# Altium schematic sheet GSB-S05-V00-PSU5V.SchDoc
size A4
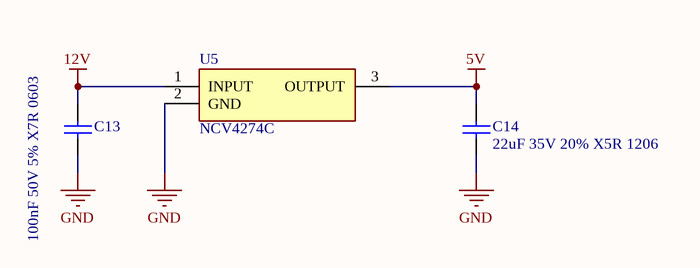
[diagram p0: GSB-S05-V00-PSU5V.SchDoc]

## Parts
C13  100nF 50V 5% X7R 0603  [Cap_Ceramic_0603]
C14  22uF 35V 20% X5R 1206  [Cap_Ceramic_1206]
U5  NCV4274C  [NCV4274CDT50RKG]

## Nets
5V: C14.2 U5.3(OUTPUT)
12V: C13.2 U5.1(INPUT)
GND: C13.1 C14.1 U5.2(GND)

## Library data of the parts
C13 = 100nF 50V 5% X7R 0603: Capacitor, Ceramic, SMD, 100nF, 50V, 5%, X7R, 0603
C14 = 22uF 35V 20% X5R 1206: 22µF ±20% 35V Ceramic Capacitor X5R 1206 (3216 Metric); ComponentLink1Description: Digikey; ComponentLink1URL: https://www.digikey.com.au/product-detail/en/tdk-corporation/C3216X5R1V226M160AC/445-8045-1-ND/2792165; ComponentLink2Description: Datasheet; ComponentLink2URL: https://product.tdk.com/info/en/catalog/datasheets/mlcc_commercial_general_en.pdf
U5 = NCV4274C: Integrated Circuit; Manufacturer_Name: ON Semiconductor; Datasheet Link: https://www.onsemi.com/pub/Collateral/NCV4274C-D.PDF; Height: 2.38mm; Manufacturer_Part_Number: NCV4274CDT50RKG; Arrow Part Number: NCV4274CDT50RKG; Arrow Price/Stock: https://www.arrow.com/en/products/ncv4274cdt50rkg/on-semiconductor; Mouser Part Number: 863-NCV4274CDT50RKG; Mouser Price/Stock: https://www.mouser.co.uk/ProductDetail/ON-Semiconductor/NCV4274CDT50RKG?qs=tCMd4XlZ%2FiBk5MdmOBr7cw%3D%3D